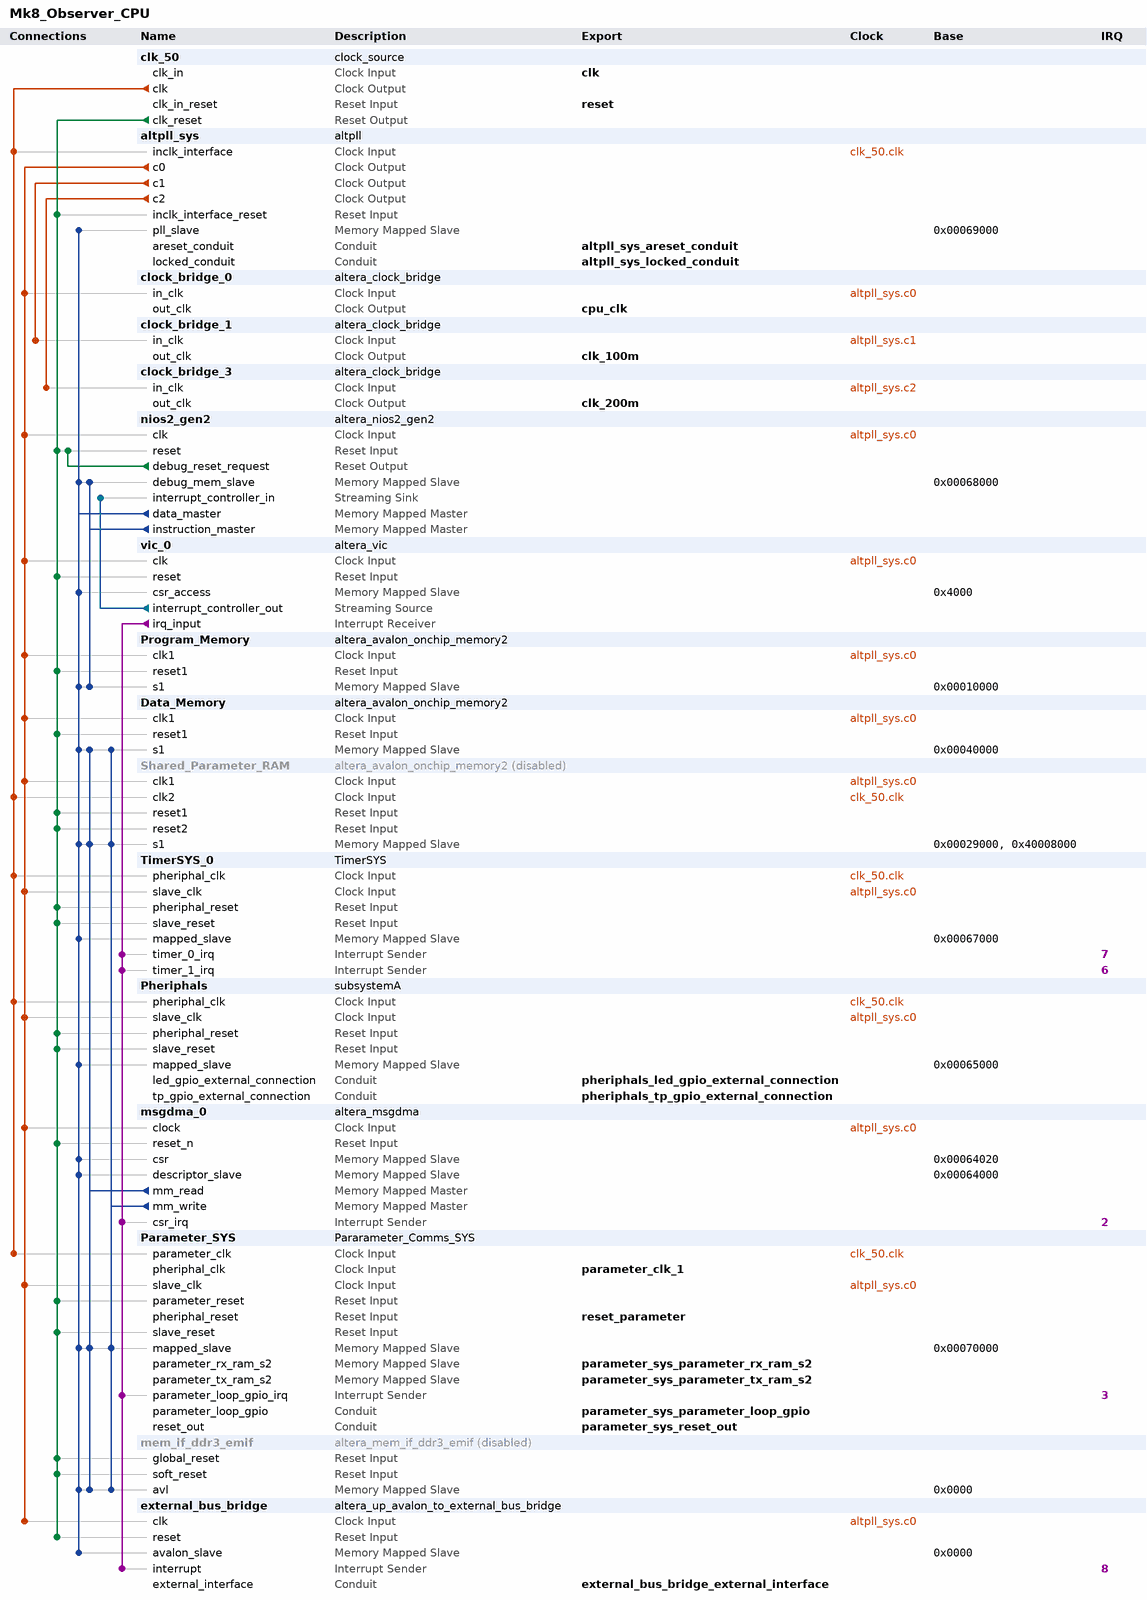
[diagram p0: system contents]
# Platform Designer (Qsys) system Mk8_Observer_CPU, MAX 10 10M50DAF484I7G
# Parameters at their usual value, and those the tool derives, are not listed.
package require -exact qsys 18.1
create_system Mk8_Observer_CPU
set_project_property DEVICE_FAMILY {MAX 10}
set_project_property DEVICE 10M50DAF484I7G

add_instance clk_50 clock_source 18.1
set_instance_parameter_value clk_50 clockFrequency 50000000

add_instance altpll_sys altpll 18.1
set_instance_parameter_value altpll_sys CLK0_DIVIDE_BY 1
set_instance_parameter_value altpll_sys CLK0_MULTIPLY_BY 2
set_instance_parameter_value altpll_sys CLK1_DIVIDE_BY 1
set_instance_parameter_value altpll_sys CLK1_DUTY_CYCLE 50
set_instance_parameter_value altpll_sys CLK1_MULTIPLY_BY 2
set_instance_parameter_value altpll_sys CLK1_PHASE_SHIFT 0
set_instance_parameter_value altpll_sys CLK2_DIVIDE_BY 1
set_instance_parameter_value altpll_sys CLK2_DUTY_CYCLE 50
set_instance_parameter_value altpll_sys CLK2_MULTIPLY_BY 4
set_instance_parameter_value altpll_sys CLK2_PHASE_SHIFT 0
set_instance_parameter_value altpll_sys CLK3_DIVIDE_BY 5
set_instance_parameter_value altpll_sys CLK3_DUTY_CYCLE 50
set_instance_parameter_value altpll_sys CLK3_MULTIPLY_BY 4
set_instance_parameter_value altpll_sys CLK3_PHASE_SHIFT 0
set_instance_parameter_value altpll_sys CLK4_DIVIDE_BY 1
set_instance_parameter_value altpll_sys CLK4_DUTY_CYCLE 50
set_instance_parameter_value altpll_sys CLK4_MULTIPLY_BY 4
set_instance_parameter_value altpll_sys CLK4_PHASE_SHIFT 0
set_instance_parameter_value altpll_sys INCLK0_INPUT_FREQUENCY 20000
set_instance_parameter_value altpll_sys PORT_ARESET PORT_USED
set_instance_parameter_value altpll_sys PORT_LOCKED PORT_USED
set_instance_parameter_value altpll_sys PORT_clk1 PORT_USED
set_instance_parameter_value altpll_sys PORT_clk2 PORT_USED
set_instance_parameter_value altpll_sys PORT_clk3 PORT_UNUSED

add_instance clock_bridge_0 altera_clock_bridge 18.1
set_instance_parameter_value clock_bridge_0 DERIVED_CLOCK_RATE 100000000
set_instance_parameter_value clock_bridge_0 EXPLICIT_CLOCK_RATE 0

add_instance clock_bridge_1 altera_clock_bridge 18.1
set_instance_parameter_value clock_bridge_1 DERIVED_CLOCK_RATE 100000000
set_instance_parameter_value clock_bridge_1 EXPLICIT_CLOCK_RATE 0

add_instance clock_bridge_3 altera_clock_bridge 18.1
set_instance_parameter_value clock_bridge_3 DERIVED_CLOCK_RATE 200000000
set_instance_parameter_value clock_bridge_3 EXPLICIT_CLOCK_RATE 0

add_instance nios2_gen2 altera_nios2_gen2 18.1
set_instance_parameter_value nios2_gen2 dcache_size 4096
set_instance_parameter_value nios2_gen2 exceptionSlave Program_Memory.s1
set_instance_parameter_value nios2_gen2 icache_size 4096
set_instance_parameter_value nios2_gen2 impl Fast
set_instance_parameter_value nios2_gen2 io_regionbase 262144
set_instance_parameter_value nios2_gen2 io_regionsize 262144
set_instance_parameter_value nios2_gen2 mul_64_impl 1
set_instance_parameter_value nios2_gen2 mul_shift_choice 1
set_instance_parameter_value nios2_gen2 resetSlave Program_Memory.s1
set_instance_parameter_value nios2_gen2 setting_interruptControllerType External
set_instance_parameter_value nios2_gen2 setting_shadowRegisterSets 8

add_instance vic_0 altera_vic 18.1
set_instance_parameter_value vic_0 DAISY_CHAIN_ENABLE 0
set_instance_parameter_value vic_0 INTERRUPT_LATENCY_CYCLES 2
set_instance_parameter_value vic_0 NUMBER_OF_INT_PORTS 9
set_instance_parameter_value vic_0 OVERRIDE_INTERRUPT_LATENCY false
set_instance_parameter_value vic_0 RIL_WIDTH 4

add_instance Program_Memory altera_avalon_onchip_memory2 18.1
set_instance_parameter_value Program_Memory dataWidth 32
set_instance_parameter_value Program_Memory dualPort false
set_instance_parameter_value Program_Memory initMemContent false
set_instance_parameter_value Program_Memory initializationFileName onchip_mem.hex
set_instance_parameter_value Program_Memory memorySize 16384

add_instance Data_Memory altera_avalon_onchip_memory2 18.1
set_instance_parameter_value Data_Memory dataWidth 32
set_instance_parameter_value Data_Memory dualPort false
set_instance_parameter_value Data_Memory initMemContent false
set_instance_parameter_value Data_Memory initializationFileName onchip_mem.hex
set_instance_parameter_value Data_Memory memorySize 102400

add_instance Shared_Parameter_RAM altera_avalon_onchip_memory2 18.1
set_instance_property Shared_Parameter_RAM ENABLED false
set_instance_parameter_value Shared_Parameter_RAM dataWidth 32
set_instance_parameter_value Shared_Parameter_RAM dualPort true
set_instance_parameter_value Shared_Parameter_RAM enableDiffWidth true
set_instance_parameter_value Shared_Parameter_RAM initMemContent false
set_instance_parameter_value Shared_Parameter_RAM initializationFileName onchip_mem.hex
set_instance_parameter_value Shared_Parameter_RAM memorySize 1024

add_instance TimerSYS_0 TimerSYS 1.0

add_instance Pheriphals subsystemA 1.0

add_instance msgdma_0 altera_msgdma 18.1
set_instance_parameter_value msgdma_0 BURST_ENABLE 0
set_instance_parameter_value msgdma_0 DATA_FIFO_DEPTH 32
set_instance_parameter_value msgdma_0 DATA_WIDTH 32
set_instance_parameter_value msgdma_0 DESCRIPTOR_FIFO_DEPTH 128
set_instance_parameter_value msgdma_0 ENHANCED_FEATURES 1
set_instance_parameter_value msgdma_0 ERROR_ENABLE 0
set_instance_parameter_value msgdma_0 MAX_BURST_COUNT 2
set_instance_parameter_value msgdma_0 MAX_BYTE 4096
set_instance_parameter_value msgdma_0 MODE 0
set_instance_parameter_value msgdma_0 PACKET_ENABLE 0
set_instance_parameter_value msgdma_0 STRIDE_ENABLE 1
set_instance_parameter_value msgdma_0 TRANSFER_TYPE {Full Word Accesses Only}

add_instance Parameter_SYS Pararameter_Comms_SYS 1.0

add_instance mem_if_ddr3_emif altera_mem_if_ddr3_emif 18.1
set_instance_property mem_if_ddr3_emif ENABLED false
set_instance_parameter_value mem_if_ddr3_emif AVL_MAX_SIZE 4
set_instance_parameter_value mem_if_ddr3_emif CALIBRATION_MODE Skip
set_instance_parameter_value mem_if_ddr3_emif CPORT_TYPE_PORT Bidirectional,Bidirectional,Bidirectional,Bidirectional,Bidirectional,Bidirectional
set_instance_parameter_value mem_if_ddr3_emif EXPORT_AFI_HALF_CLK false
set_instance_parameter_value mem_if_ddr3_emif HARD_EMIF false
set_instance_parameter_value mem_if_ddr3_emif MEM_BANKADDR_WIDTH 3
set_instance_parameter_value mem_if_ddr3_emif MEM_CLK_FREQ 300.0
set_instance_parameter_value mem_if_ddr3_emif MEM_CLK_FREQ_MAX 800.0
set_instance_parameter_value mem_if_ddr3_emif MEM_COL_ADDR_WIDTH 10
set_instance_parameter_value mem_if_ddr3_emif MEM_DQ_WIDTH 16
set_instance_parameter_value mem_if_ddr3_emif MEM_FORMAT DISCRETE
set_instance_parameter_value mem_if_ddr3_emif MEM_ROW_ADDR_WIDTH 16
set_instance_parameter_value mem_if_ddr3_emif MEM_TCL 7
set_instance_parameter_value mem_if_ddr3_emif MEM_TFAW_NS 45.0
set_instance_parameter_value mem_if_ddr3_emif MEM_TRAS_NS 35.0
set_instance_parameter_value mem_if_ddr3_emif MEM_TRCD_NS 13.75
set_instance_parameter_value mem_if_ddr3_emif MEM_TRFC_NS 260.0
set_instance_parameter_value mem_if_ddr3_emif MEM_TRP_NS 13.75
set_instance_parameter_value mem_if_ddr3_emif MEM_TRRD_NS 7.5
set_instance_parameter_value mem_if_ddr3_emif MEM_TRTP_NS 7.5
set_instance_parameter_value mem_if_ddr3_emif MEM_TWTR 6
set_instance_parameter_value mem_if_ddr3_emif MEM_VENDOR Micron
set_instance_parameter_value mem_if_ddr3_emif MEM_WTCL 6
set_instance_parameter_value mem_if_ddr3_emif PLL_LOCATION Top_Bottom
set_instance_parameter_value mem_if_ddr3_emif POWER_OF_TWO_BUS true
set_instance_parameter_value mem_if_ddr3_emif PRIORITY_PORT 1,1,1,1,1,1
set_instance_parameter_value mem_if_ddr3_emif RATE Half
set_instance_parameter_value mem_if_ddr3_emif REF_CLK_FREQ 60.0
set_instance_parameter_value mem_if_ddr3_emif SPEED_GRADE 6
set_instance_parameter_value mem_if_ddr3_emif TIMING_BOARD_AC_SKEW 0.017
set_instance_parameter_value mem_if_ddr3_emif TIMING_BOARD_AC_TO_CK_SKEW -1.3E-4
set_instance_parameter_value mem_if_ddr3_emif TIMING_BOARD_DQ_TO_DQS_SKEW -6.0E-4
set_instance_parameter_value mem_if_ddr3_emif TIMING_BOARD_MAX_CK_DELAY 0.183
set_instance_parameter_value mem_if_ddr3_emif TIMING_BOARD_MAX_DQS_DELAY 0.181
set_instance_parameter_value mem_if_ddr3_emif TIMING_BOARD_SKEW_BETWEEN_DQS 0.005
set_instance_parameter_value mem_if_ddr3_emif TIMING_BOARD_SKEW_CKDQS_DIMM_MAX 0.007
set_instance_parameter_value mem_if_ddr3_emif TIMING_BOARD_SKEW_CKDQS_DIMM_MIN 0.002
set_instance_parameter_value mem_if_ddr3_emif TIMING_BOARD_SKEW_WITHIN_DQS 0.008
set_instance_parameter_value mem_if_ddr3_emif TIMING_TDH 55
set_instance_parameter_value mem_if_ddr3_emif TIMING_TDQSCK 225
set_instance_parameter_value mem_if_ddr3_emif TIMING_TDQSQ 125
set_instance_parameter_value mem_if_ddr3_emif TIMING_TDQSS 0.25
set_instance_parameter_value mem_if_ddr3_emif TIMING_TDS 55
set_instance_parameter_value mem_if_ddr3_emif TIMING_TDSH 0.2
set_instance_parameter_value mem_if_ddr3_emif TIMING_TDSS 0.2
set_instance_parameter_value mem_if_ddr3_emif TIMING_TIH 130
set_instance_parameter_value mem_if_ddr3_emif TIMING_TIS 185
set_instance_parameter_value mem_if_ddr3_emif TIMING_TQSH 0.4
set_instance_parameter_value mem_if_ddr3_emif USER_DEBUG_LEVEL 1

add_instance external_bus_bridge altera_up_avalon_to_external_bus_bridge 18.0
set_instance_parameter_value external_bus_bridge addr_size 256
set_instance_parameter_value external_bus_bridge addr_size_multiplier bytes
set_instance_parameter_value external_bus_bridge data_size 8

# connections
add_connection altpll_sys.c0 clock_bridge_0.in_clk clock
add_connection altpll_sys.c0 Data_Memory.clk1 clock
add_connection altpll_sys.c0 external_bus_bridge.clk clock
add_connection altpll_sys.c0 msgdma_0.clock clock
add_connection altpll_sys.c0 nios2_gen2.clk clock
add_connection altpll_sys.c0 Parameter_SYS.slave_clk clock
add_connection altpll_sys.c0 Pheriphals.slave_clk clock
add_connection altpll_sys.c0 Program_Memory.clk1 clock
add_connection altpll_sys.c0 Shared_Parameter_RAM.clk1 clock
add_connection altpll_sys.c0 TimerSYS_0.slave_clk clock
add_connection altpll_sys.c0 vic_0.clk clock
add_connection altpll_sys.c1 clock_bridge_1.in_clk clock
add_connection altpll_sys.c2 clock_bridge_3.in_clk clock
add_connection clk_50.clk altpll_sys.inclk_interface clock
add_connection clk_50.clk Parameter_SYS.parameter_clk clock
add_connection clk_50.clk Pheriphals.pheriphal_clk clock
add_connection clk_50.clk Shared_Parameter_RAM.clk2 clock
add_connection clk_50.clk TimerSYS_0.pheriphal_clk clock
add_connection clk_50.clk_reset altpll_sys.inclk_interface_reset reset
add_connection clk_50.clk_reset Data_Memory.reset1 reset
add_connection clk_50.clk_reset external_bus_bridge.reset reset
add_connection clk_50.clk_reset mem_if_ddr3_emif.global_reset reset
add_connection clk_50.clk_reset mem_if_ddr3_emif.soft_reset reset
add_connection clk_50.clk_reset msgdma_0.reset_n reset
add_connection clk_50.clk_reset nios2_gen2.reset reset
add_connection clk_50.clk_reset Parameter_SYS.parameter_reset reset
add_connection clk_50.clk_reset Parameter_SYS.slave_reset reset
add_connection clk_50.clk_reset Pheriphals.pheriphal_reset reset
add_connection clk_50.clk_reset Pheriphals.slave_reset reset
add_connection clk_50.clk_reset Program_Memory.reset1 reset
add_connection clk_50.clk_reset Shared_Parameter_RAM.reset1 reset
add_connection clk_50.clk_reset Shared_Parameter_RAM.reset2 reset
add_connection clk_50.clk_reset TimerSYS_0.pheriphal_reset reset
add_connection clk_50.clk_reset TimerSYS_0.slave_reset reset
add_connection clk_50.clk_reset vic_0.reset reset
add_connection nios2_gen2.debug_reset_request nios2_gen2.reset reset
add_connection msgdma_0.mm_read Data_Memory.s1 avalon
set_connection_parameter_value msgdma_0.mm_read/Data_Memory.s1 baseAddress 0x00040000
add_connection msgdma_0.mm_read mem_if_ddr3_emif.avl avalon
set_connection_parameter_value msgdma_0.mm_read/mem_if_ddr3_emif.avl baseAddress 0x0000
add_connection msgdma_0.mm_read Parameter_SYS.mapped_slave avalon
set_connection_parameter_value msgdma_0.mm_read/Parameter_SYS.mapped_slave baseAddress 0x00070000
add_connection msgdma_0.mm_read Shared_Parameter_RAM.s1 avalon
set_connection_parameter_value msgdma_0.mm_read/Shared_Parameter_RAM.s1 baseAddress 0x40008000
add_connection msgdma_0.mm_write Data_Memory.s1 avalon
set_connection_parameter_value msgdma_0.mm_write/Data_Memory.s1 baseAddress 0x00040000
add_connection msgdma_0.mm_write mem_if_ddr3_emif.avl avalon
set_connection_parameter_value msgdma_0.mm_write/mem_if_ddr3_emif.avl baseAddress 0x0000
add_connection msgdma_0.mm_write Parameter_SYS.mapped_slave avalon
set_connection_parameter_value msgdma_0.mm_write/Parameter_SYS.mapped_slave baseAddress 0x00070000
add_connection msgdma_0.mm_write Shared_Parameter_RAM.s1 avalon
set_connection_parameter_value msgdma_0.mm_write/Shared_Parameter_RAM.s1 baseAddress 0x40008000
add_connection nios2_gen2.data_master altpll_sys.pll_slave avalon
set_connection_parameter_value nios2_gen2.data_master/altpll_sys.pll_slave baseAddress 0x00069000
add_connection nios2_gen2.data_master Data_Memory.s1 avalon
set_connection_parameter_value nios2_gen2.data_master/Data_Memory.s1 baseAddress 0x00040000
add_connection nios2_gen2.data_master external_bus_bridge.avalon_slave avalon
set_connection_parameter_value nios2_gen2.data_master/external_bus_bridge.avalon_slave baseAddress 0x0000
add_connection nios2_gen2.data_master mem_if_ddr3_emif.avl avalon
set_connection_parameter_value nios2_gen2.data_master/mem_if_ddr3_emif.avl baseAddress 0x0000
add_connection nios2_gen2.data_master msgdma_0.csr avalon
set_connection_parameter_value nios2_gen2.data_master/msgdma_0.csr baseAddress 0x00064020
add_connection nios2_gen2.data_master msgdma_0.descriptor_slave avalon
set_connection_parameter_value nios2_gen2.data_master/msgdma_0.descriptor_slave baseAddress 0x00064000
add_connection nios2_gen2.data_master nios2_gen2.debug_mem_slave avalon
set_connection_parameter_value nios2_gen2.data_master/nios2_gen2.debug_mem_slave baseAddress 0x00068000
add_connection nios2_gen2.data_master Parameter_SYS.mapped_slave avalon
set_connection_parameter_value nios2_gen2.data_master/Parameter_SYS.mapped_slave baseAddress 0x00070000
add_connection nios2_gen2.data_master Pheriphals.mapped_slave avalon
set_connection_parameter_value nios2_gen2.data_master/Pheriphals.mapped_slave baseAddress 0x00065000
add_connection nios2_gen2.data_master Program_Memory.s1 avalon
set_connection_parameter_value nios2_gen2.data_master/Program_Memory.s1 baseAddress 0x00010000
add_connection nios2_gen2.data_master Shared_Parameter_RAM.s1 avalon
set_connection_parameter_value nios2_gen2.data_master/Shared_Parameter_RAM.s1 baseAddress 0x00029000
add_connection nios2_gen2.data_master TimerSYS_0.mapped_slave avalon
set_connection_parameter_value nios2_gen2.data_master/TimerSYS_0.mapped_slave baseAddress 0x00067000
add_connection nios2_gen2.data_master vic_0.csr_access avalon
set_connection_parameter_value nios2_gen2.data_master/vic_0.csr_access baseAddress 0x4000
add_connection nios2_gen2.instruction_master nios2_gen2.debug_mem_slave avalon
set_connection_parameter_value nios2_gen2.instruction_master/nios2_gen2.debug_mem_slave baseAddress 0x00068000
add_connection nios2_gen2.instruction_master Program_Memory.s1 avalon
set_connection_parameter_value nios2_gen2.instruction_master/Program_Memory.s1 baseAddress 0x00010000
add_connection vic_0.interrupt_controller_out nios2_gen2.interrupt_controller_in avalon_streaming
add_connection vic_0.irq_input external_bus_bridge.interrupt interrupt
set_connection_parameter_value vic_0.irq_input/external_bus_bridge.interrupt irqNumber 8
add_connection vic_0.irq_input msgdma_0.csr_irq interrupt
set_connection_parameter_value vic_0.irq_input/msgdma_0.csr_irq irqNumber 2
add_connection vic_0.irq_input Parameter_SYS.parameter_loop_gpio_irq interrupt
set_connection_parameter_value vic_0.irq_input/Parameter_SYS.parameter_loop_gpio_irq irqNumber 3
add_connection vic_0.irq_input TimerSYS_0.timer_0_irq interrupt
set_connection_parameter_value vic_0.irq_input/TimerSYS_0.timer_0_irq irqNumber 7
add_connection vic_0.irq_input TimerSYS_0.timer_1_irq interrupt
set_connection_parameter_value vic_0.irq_input/TimerSYS_0.timer_1_irq irqNumber 6

# exported interfaces
add_interface altpll_sys_areset_conduit conduit end
set_interface_property altpll_sys_areset_conduit EXPORT_OF altpll_sys.areset_conduit
add_interface altpll_sys_locked_conduit conduit end
set_interface_property altpll_sys_locked_conduit EXPORT_OF altpll_sys.locked_conduit
add_interface clk clock sink
set_interface_property clk EXPORT_OF clk_50.clk_in
add_interface clk_100m clock source
set_interface_property clk_100m EXPORT_OF clock_bridge_1.out_clk
add_interface clk_200m clock source
set_interface_property clk_200m EXPORT_OF clock_bridge_3.out_clk
add_interface cpu_clk clock source
set_interface_property cpu_clk EXPORT_OF clock_bridge_0.out_clk
add_interface external_bus_bridge_external_interface conduit end
set_interface_property external_bus_bridge_external_interface EXPORT_OF external_bus_bridge.external_interface
add_interface parameter_clk_1 clock sink
set_interface_property parameter_clk_1 EXPORT_OF Parameter_SYS.pheriphal_clk
add_interface parameter_sys_parameter_loop_gpio conduit end
set_interface_property parameter_sys_parameter_loop_gpio EXPORT_OF Parameter_SYS.parameter_loop_gpio
add_interface parameter_sys_parameter_rx_ram_s2 avalon slave
set_interface_property parameter_sys_parameter_rx_ram_s2 EXPORT_OF Parameter_SYS.parameter_rx_ram_s2
add_interface parameter_sys_parameter_tx_ram_s2 avalon slave
set_interface_property parameter_sys_parameter_tx_ram_s2 EXPORT_OF Parameter_SYS.parameter_tx_ram_s2
add_interface parameter_sys_reset_out conduit end
set_interface_property parameter_sys_reset_out EXPORT_OF Parameter_SYS.reset_out
add_interface pheriphals_led_gpio_external_connection conduit end
set_interface_property pheriphals_led_gpio_external_connection EXPORT_OF Pheriphals.led_gpio_external_connection
add_interface pheriphals_tp_gpio_external_connection conduit end
set_interface_property pheriphals_tp_gpio_external_connection EXPORT_OF Pheriphals.tp_gpio_external_connection
add_interface reset reset sink
set_interface_property reset EXPORT_OF clk_50.clk_in_reset
add_interface reset_parameter reset sink
set_interface_property reset_parameter EXPORT_OF Parameter_SYS.pheriphal_reset

set_interconnect_requirement {$system} qsys_mm.clockCrossingAdapter HANDSHAKE
set_interconnect_requirement {$system} qsys_mm.enableEccProtection FALSE
set_interconnect_requirement {$system} qsys_mm.insertDefaultSlave FALSE
set_interconnect_requirement {$system} qsys_mm.maxAdditionalLatency 1

save_system Mk8_Observer_CPU.qsys
